# Altium project BLE-T1.PrjPcb
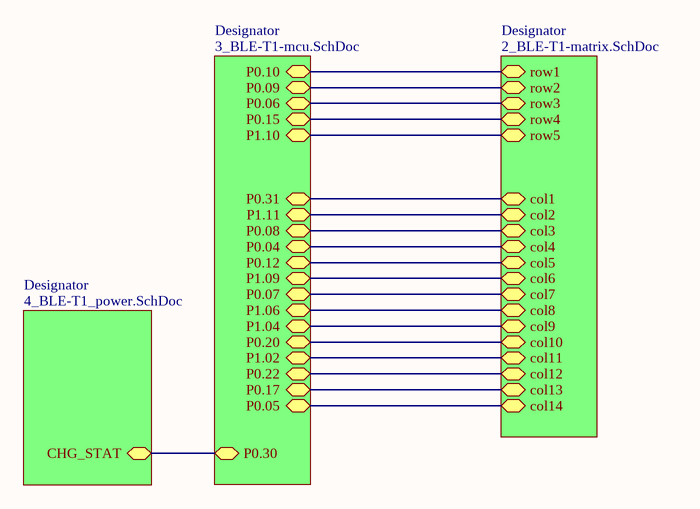
[diagram p0: 1_BLE-T1_top.SchDoc]
4 sheets, 185 parts. Net scope: hierarchical (ports join the sheet entries above them; power ports are global).
Board file: BLE-T1.PcbDoc
Sheets:
  1_BLE-T1_top.SchDoc
    Designator = 3_BLE-T1-mcu.SchDoc
    Designator = 2_BLE-T1-matrix.SchDoc
    Designator = 4_BLE-T1_power.SchDoc

## Sheet 1_BLE-T1_top.SchDoc: waffling60 - PCB
size A4; Engineer: 4pplet; Revision: RevA; ProjectName: waffling60

### Sub-sheets
Designator = 3_BLE-T1-mcu.SchDoc: P1.02, P1.04, P0.17, P0.09, P0.20, P1.06, P0.10, P0.22, P0.12, P0.15, P0.06, P1.09, P1.11, P0.08, P0.31, P0.04, P0.05, P1.10, P0.30, P0.07
Designator = 2_BLE-T1-matrix.SchDoc: col6, col8, col5, col7, col3, col2, col1, col4, col9, row3, row1, row4, row2, row5, col11, col10, col13, col14, col12
Designator = 4_BLE-T1_power.SchDoc: CHG_STAT

### Nets
col1: sheet Designator/P0.31, sheet Designator/col1
col2: sheet Designator/P1.11, sheet Designator/col2
col3: sheet Designator/P0.08, sheet Designator/col3
col4: sheet Designator/P0.04, sheet Designator/col4
col5: sheet Designator/P0.12, sheet Designator/col5
col6: sheet Designator/P1.09, sheet Designator/col6
col7: sheet Designator/P0.07, sheet Designator/col7
col8: sheet Designator/P1.06, sheet Designator/col8
col9: sheet Designator/P1.04, sheet Designator/col9
col10: sheet Designator/P0.20, sheet Designator/col10
col11: sheet Designator/P1.02, sheet Designator/col11
col12: sheet Designator/P0.22, sheet Designator/col12
row1: sheet Designator/P0.10, sheet Designator/row1
row2: sheet Designator/P0.09, sheet Designator/row2
row3: sheet Designator/P0.06, sheet Designator/row3
row4: sheet Designator/P0.15, sheet Designator/row4
row5: sheet Designator/P1.10, sheet Designator/row5
NetR401_2: sheet Designator/P0.30, sheet Designator/CHG_STAT
NetS213_2: sheet Designator/P0.17, sheet Designator/col13
NetS214_2: sheet Designator/P0.05, sheet Designator/col14

## Sheet 3_BLE-T1-mcu.SchDoc
size A4
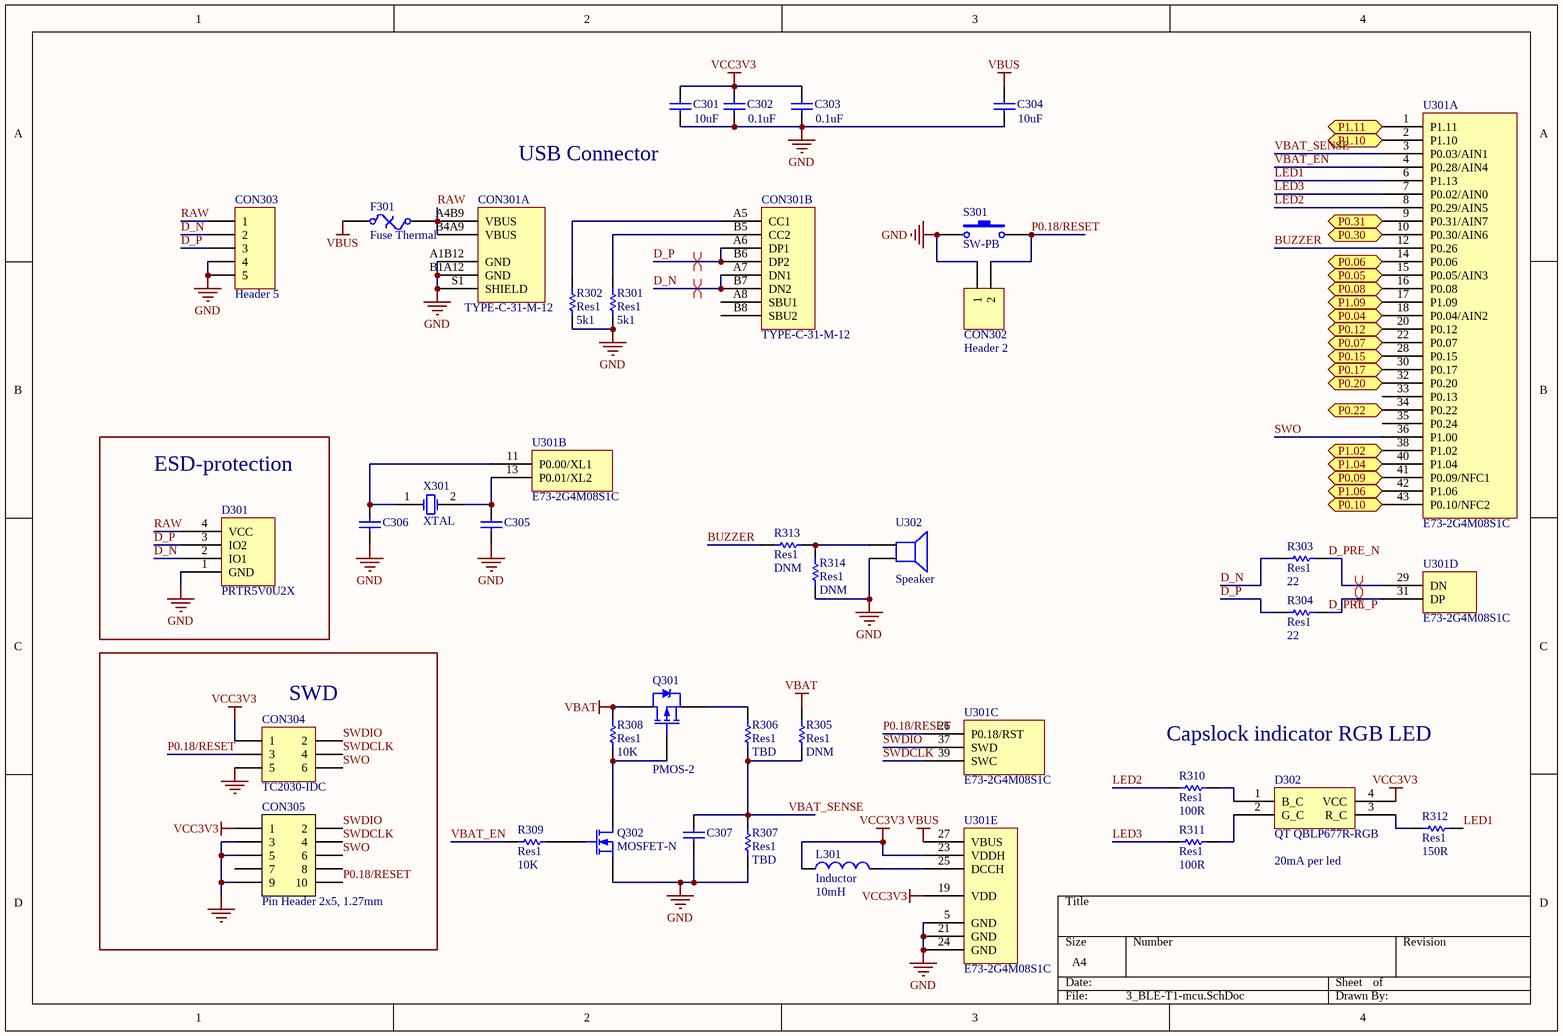
[diagram p1: 3_BLE-T1-mcu.SchDoc]

### Parts
C301  value 10uF  [C1206[3216]]
C302  value 0.1uF  [C0603[1608]]
C303  value 0.1uF  [C0603[1608]]
C304  value 10uF  [C1206[3216]]
C305  (no value)  [C0603[1608]]
C306  (no value)  [C0603[1608]]
C307  (no value)  [C0603[1608]]
CON301  TYPE-C-31-M-12  [TYPE-C-31-M-12]  (parts A,B of 2)
CON302  Header 2  [HDR1X2]  (no BOM)
CON303  Header 5  [JST SM04B-SRSS-TB]
CON304  TC2030-IDC  [TC2030-IDC-NL]  (no BOM)
CON305  Pin Header 2x5, 1.27mm  [HDR_2x5-SMD-1.27mm-K]
D301  PRTR5V0U2X  [SOT190P237X120-4N]
D302  QT QBLP677R-RGB  [QT QBLP677R-RGB]
F301  Fuse Thermal  [C1206[3216]]
L301  Inductor  value 10mH  [C0603[1608]]
Q301  PMOS-2  [SOT-23-3]
Q302  MOSFET-N  [SOT-23-3]
R301  Res1  value 5k1  [R0603[1608]]
R302  Res1  value 5k1  [R0603[1608]]
R303  Res1  value 22  [R0603[1608]]
R304  Res1  value 22  [R0603[1608]]
R305  Res1  value DNM  [R0603[1608]]
R306  Res1  value TBD  [R0603[1608]]
R307  Res1  value TBD  [R0603[1608]]
R308  Res1  value 10K  [R0603[1608]]
R309  Res1  value 10K  [R0603[1608]]
R310  Res1  value 100R  [R0603[1608]]
R311  Res1  value 100R  [R0603[1608]]
R312  Res1  value 150R  [R0603[1608]]
R313  Res1  value DNM  [R0603[1608]]
R314  Res1  value DNM  [R0603[1608]]
S301  SW-PB  [Combo switch]
U301  E73-2G4M08S1C  [E73-2G4M08S1C BLE-T1]  (parts A,B,C,D,E of 5)
U302  Speaker  [buzzer 12x12]
X301  XTAL  [Seiko Epson Q13FC1350000400]

### Blocks framed on the sheet
ESD-protection: D301
SWD: CON304 CON305

### Ports
P0.04, P0.05, P0.06, P0.07, P0.08, P0.09, P0.10, P0.12, P0.15, P0.17, P0.20, P0.22, P0.30, P0.31, P1.02, P1.04, P1.06, P1.09, P1.10, P1.11

### Nets
GND: C301.1 C302.1 C303.1 C304.1 C305.1 C306.1 C307.1 CON301.A1B12(GND) CON301.B1A12(GND) CON301.S1(SHIELD) CON302.1 CON303.4 CON303.5 CON304.5 CON305.3 CON305.5 CON305.9 D301.1(GND) Q302.2(S) R301.2 R302.2 R307.1 R314.1 S301.1 U301.5(GND) U301.21(GND) U301.24(GND) U302.2
VBAT: Q301.3(D) R305.2 R308.2
VBUS: C304.2 F301.1 U301.27(VBUS)
VCC3V3: C301.2 C302.2 C303.2 CON304.1 CON305.1 D302.4(VCC) L301.1 U301.19(VDD) U301.23(VDDH)
BUZZER: R313.1 U301.12(P0.26)
col1: U301.9(P0.31/AIN7) ; port P0.31
col2: U301.1(P1.11) ; port P1.11
col3: U301.16(P0.08) ; port P0.08
col4: U301.18(P0.04/AIN2) ; port P0.04
col5: U301.20(P0.12) ; port P0.12
col6: U301.17(P1.09) ; port P1.09
col7: U301.22(P0.07) ; port P0.07
col8: U301.42(P1.06) ; port P1.06
col9: U301.40(P1.04) ; port P1.04
col10: U301.32(P0.20) ; port P0.20
col11: U301.38(P1.02) ; port P1.02
col12: U301.34(P0.22) ; port P0.22
D_N: CON301.A7(DN1) CON301.B7(DN2) CON303.2 D301.2(IO1) R303.2
D_P: CON301.A6(DP1) CON301.B6(DP2) CON303.3 D301.3(IO2) R304.2
D_PRE_N: R303.1 U301.29(DN)
D_PRE_P: R304.1 U301.31(DP)
LED1: R312.1 U301.6(P1.13)
LED2: R310.2 U301.8(P0.29/AIN5)
LED3: R311.2 U301.7(P0.02/AIN0)
P0.18/RESET: CON302.2 CON304.3 CON305.10 S301.2 U301.26(P0.18/RST)
RAW: CON301.A4B9(VBUS) CON301.B4A9(VBUS) CON303.1 D301.4(VCC) F301.2
row1: U301.43(P0.10/NFC2) ; port P0.10
row2: U301.41(P0.09/NFC1) ; port P0.09
row3: U301.14(P0.06) ; port P0.06
row4: U301.28(P0.15) ; port P0.15
row5: U301.2(P1.10) ; port P1.10
SWDCLK: CON304.4 CON305.4 U301.39(SWC)
SWDIO: CON304.2 CON305.2 U301.37(SWD)
SWO: CON304.6 CON305.6 U301.36(P1.00)
VBAT_EN: R309.2 U301.4(P0.28/AIN4)
VBAT_SENSE: C307.2 R305.1 R306.1 R307.2 U301.3(P0.03/AIN1)
NetC305_2: C305.2 U301.13(P0.01/XL2) X301.2(OSC2)
NetC306_2: C306.2 U301.11(P0.00/XL1) X301.1(OSC1)
NetCON301_A5: CON301.A5(CC1) R302.1
NetCON301_B5: CON301.B5(CC2) R301.1
NetD302_1: D302.1(B_C) R310.1
NetD302_2: D302.2(G_C) R311.1
NetD302_3: D302.3(R_C) R312.2
NetL301_2: L301.2 U301.25(DCCH)
NetQ301_1: Q301.1(G) Q302.3(D) R308.1
NetQ301_2: Q301.2(S) R306.2
NetQ302_1: Q302.1(G) R309.1
NetR313_2: R313.2 R314.2 U302.1
NetR401_2: U301.10(P0.30/AIN6) ; port P0.30
NetS213_2: U301.30(P0.17) ; port P0.17
NetS214_2: U301.15(P0.05/AIN3) ; port P0.05

Not connected (* = marked no-connect by the designer): CON301 A8(SBU1) B8(SBU2); CON305 7 8; U301 33(P0.13) 35(P0.24)

### Layout directives
differential pair: D_N, D_P, D_PRE_N, D_PRE_P

### Notes on the sheet
- (near C301) USB Connector
- Capslock indicator RGB LED
- (near D302) 20mA per led

### Library data of the parts
C301 C304 = Cap: Capacitor; MRF.Part: C3216X7R1C106KT000N; MFG: KEMET; MFGPN: C1206C106M3PACTU; LCSC MFG: TDK; Version: 1206 imperial; LCSCPN: C342827
C302 C303 = Cap: Capacitor; MRF.Part: CC0603KRX7R9BB104; MFG: KEMET; MFGPN: C0603C104M5RACTU; LCSC MFG: YAGEO; Version: 0603 imperial; LCSCPN: C14663
C305-C307 = Cap: Capacitor; Version: 0603 imperial
CON301 = TYPE-C-31-M-12: MFG: Korean Hroparts Elec; MFGPN: TYPE-C-31-M-12; LCSC Part #: C165948; LCSC MFG: Korean Hroparts Elec; MRF.Part: TYPE-C-31-M-12
CON302 = Header 2: Header, 2-Pin; LatestRevisionDate: 17-Jul-2002; LatestRevisionNote: Re-released for DXP Platform.; Publisher: Altium Limited
CON303 = Header 5: JST for USB daughter board; MFGPN: SM04B-SRSS-TB(LF)(SN); MFG: JST Sales America Inc.; LCSC MFG: JST Sales America; LCSC Part #: C160404; MRF.Part: SM04B-SRSS-TB(LF)(SN)
CON304 = Header 3X2: Header, 3-Pin, Dual row
CON305 = Pin Header 2x5 SMD, 1.27mm, KS: Pin Header 2x5, 1.27mm (50mil), SMD, Keying Shroud; MFG: Samtec Inc.; MFGPN: FTSH-105-01-F-DV-K-TR; Value: Pin Header 2x5, 1.27mm
D301 = PRTR5V0U2X: MRF.Part: UET14A05L03; MFG: Nexperia USA Inc.; MFGPN: PRTR5V0U2X,215; LCSC MFG: Brightking Elec (TAIWAN); LCSC Part #: C78442
D302 = QT QBLP677R-RGB: RGB LED; MFG: QT Brightek (QTB); MFGPN: QBLP677R-RGB; Version: Common Anode RGB LED
F301 = Fuse Thermal: Thermal Fuse; MRF.Part: ASMD1206-050; MFG: Bel Fuse Inc.; MFGPN: 0ZCJ0050FF2G; LCSC MFG: Shenzhen JDT Fuse; LCSC Part #: C135338
L301 = Inductor: Code_IEC: 1005; Published: 8-Jun-2000; LatestRevisionDate: 29-May-2009; LatestRevisionNote: IPC-7351 Footprint Added.; PackageReference: 0402-A; Publisher: Altium Limited; PackageDescription: Chip Inductor; Code_JEITA: 0402
Q301 = PMOS-2: P-Channel Power MOSFET; Note: Pin 4 not drawn and electrically connected to Pin 2.; MFGPN: BSS84-7-F; Published: 8-Jun-2000; LatestRevisionDate: 17-Jul-2002; LatestRevisionNote: Re-released for DXP Platform.; DatasheetVersion: PD-9.390D; PackageVersion: Feb-1997; PackageReference: TO-220AB; Publisher: Altium Limited; PackageDescription: TO, Thru-Hole, Vertical, Heatsink Mounted; 3 In-Line Leads; Pitch 2.54 mm; ComponentLink1Description: Manufacturer Link; ComponentLink1URL: http://www.irf.com/; LCSCPN: C427395
Q302 = MOSFET-N: N-Channel MOSFET; MFGPN: 2N7002-7-F; LSCSPN: C501655; Published: 8-Jun-2000; LatestRevisionDate: 17-Jul-2002; LatestRevisionNote: Re-released for DXP Platform.; PackageVersion: 1995/1996; PackageReference: E3; Publisher: Altium Limited; PackageDescription: TO, Flat Index; 3 In-Line, Axial Leads; Body Dia. 4.6mm; Lead Dia. 0.5 mm (max)
R301 R302 = Res1: Resistor; MRF.Part: 0603WAF5101T5E; MFG: Panasonic Electronic Components; MFGPN: ERJ-3EKF5101V; LCSC MFG: Uniroyal Elec; Version: 0603 imperial; LCSC Part #: C23186
R303 R304 R313 R314 = Res1: Resistor; MRF.Part: 0603WAF220JT5E; MFG: Panasonic Electronic Components; MFGPN: ERJ-3EKF5101V; LCSC MFG: Uniroyal Elec; Version: 0603 imperial; LCSC Part #: C23345
R305-R309 R312 = Res1: Resistor; MFG: TE Connectivity Passive Product; MFGPN: CRGCQ0603F150R; Version: 0603 imperial
R310 R311 = Res1: Resistor; MFG: TE Connectivity Passive Product; MFGPN: CRG0603J100R; Version: 0603 imperial
S301 = SW-PB: Switch; MRF.Part: TS-1187A-C-D-B; MFGPN: PTS645SM43SMTR92 LFS; MFG: C&K; LCSC MFG: XKB Enterprise; LCSCPN: C318888
U302 = Speaker: Loudspeaker; Published: 24-Mar-1999; LatestRevisionDate: 17-Jul-2002; LatestRevisionNote: Re-released for DXP Platform.; PackageReference: PIN2; Publisher: Altium Limited
X301 = XTAL: Crystal Oscillator; MRF.Part: Q13FC1350000400; LCSC MFG: Seiko Epson; LCSC Part #: C32346

## Sheet 2_BLE-T1-matrix.SchDoc
size A3
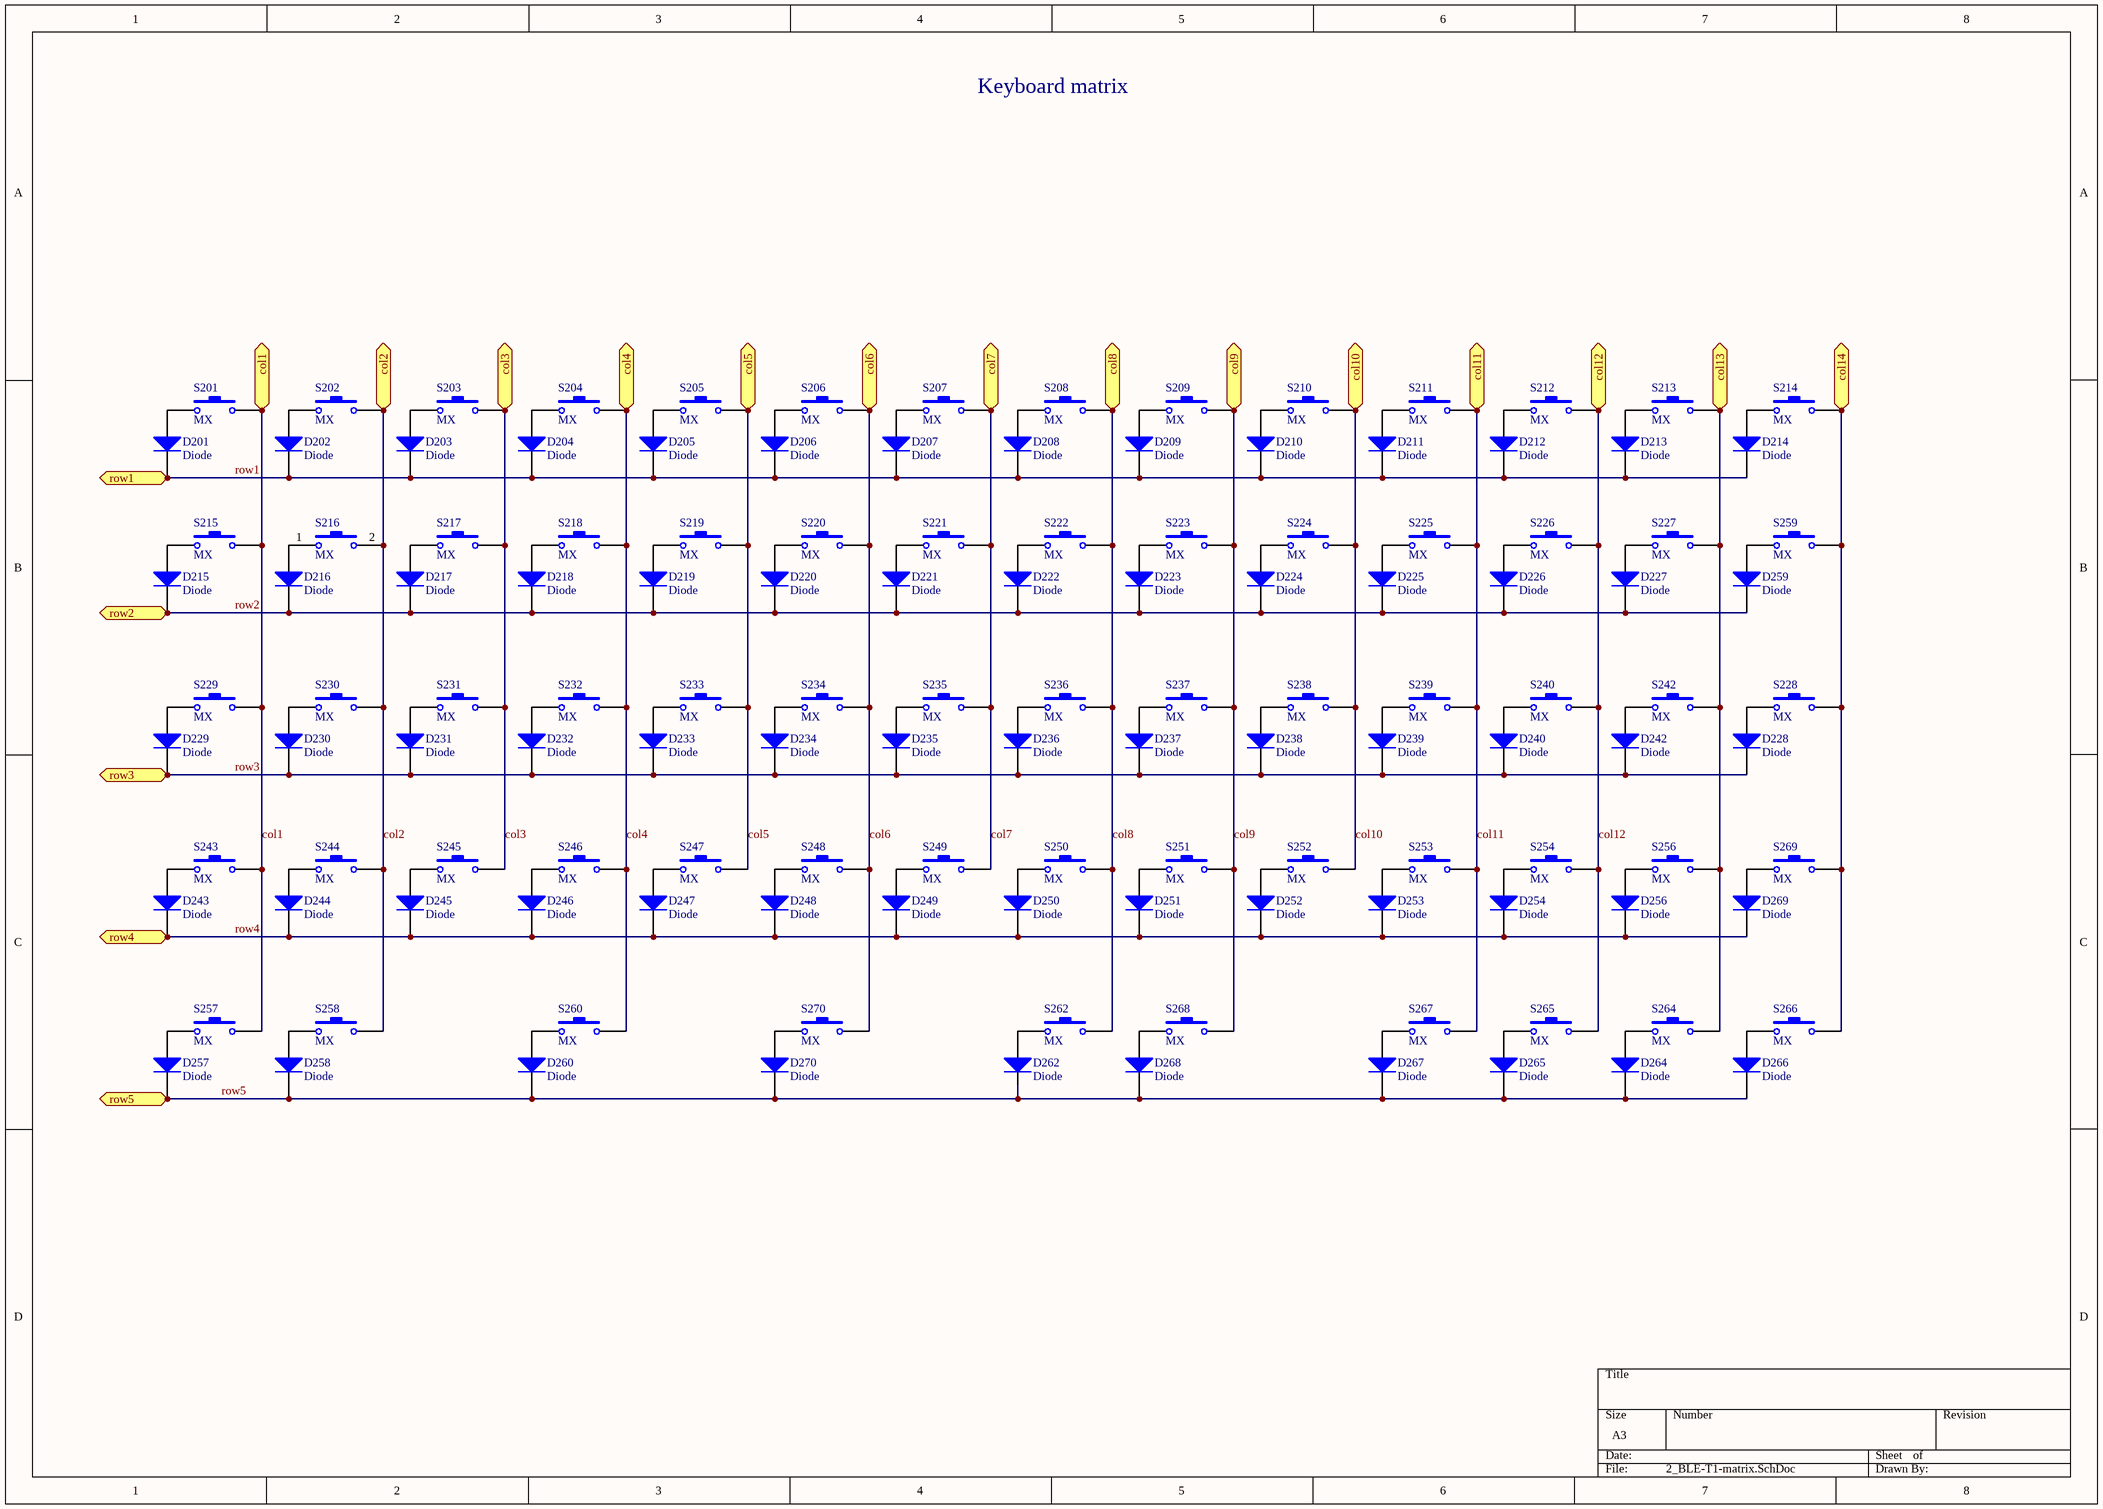
[diagram p2: 2_BLE-T1-matrix.SchDoc]

### Parts
D201  Diode  [D0603[1608]]
D202  Diode  [D0603[1608]]
D203  Diode  [D0603[1608]]
D204  Diode  [D0603[1608]]
D205  Diode  [D0603[1608]]
D206  Diode  [D0603[1608]]
D207  Diode  [D0603[1608]]
D208  Diode  [D0603[1608]]
D209  Diode  [D0603[1608]]
D210  Diode  [D0603[1608]]
D211  Diode  [D0603[1608]]
D212  Diode  [D0603[1608]]
D213  Diode  [D0603[1608]]
D214  Diode  [D0603[1608]]
D215  Diode  [D0603[1608]]
D216  Diode  [D0603[1608]]
D217  Diode  [D0603[1608]]
D218  Diode  [D0603[1608]]
D219  Diode  [D0603[1608]]
D220  Diode  [D0603[1608]]
D221  Diode  [D0603[1608]]
D222  Diode  [D0603[1608]]
D223  Diode  [D0603[1608]]
D224  Diode  [D0603[1608]]
D225  Diode  [D0603[1608]]
D226  Diode  [D0603[1608]]
D227  Diode  [D0603[1608]]
D228  Diode  [D0603[1608]]
D229  Diode  [D0603[1608]]
D230  Diode  [D0603[1608]]
D231  Diode  [D0603[1608]]
D232  Diode  [D0603[1608]]
D233  Diode  [D0603[1608]]
D234  Diode  [D0603[1608]]
D235  Diode  [D0603[1608]]
D236  Diode  [D0603[1608]]
D237  Diode  [D0603[1608]]
D238  Diode  [D0603[1608]]
D239  Diode  [D0603[1608]]
D240  Diode  [D0603[1608]]
D242  Diode  [D0603[1608]]
D243  Diode  [D0603[1608]]
D244  Diode  [D0603[1608]]
D245  Diode  [D0603[1608]]
D246  Diode  [D0603[1608]]
D247  Diode  [D0603[1608]]
D248  Diode  [D0603[1608]]
D249  Diode  [D0603[1608]]
D250  Diode  [D0603[1608]]
D251  Diode  [D0603[1608]]
D252  Diode  [D0603[1608]]
D253  Diode  [D0603[1608]]
D254  Diode  [D0603[1608]]
D256  Diode  [D0603[1608]]
D257  Diode  [D0603[1608]]
D258  Diode  [D0603[1608]]
D259  Diode  [D0603[1608]]
D260  Diode  [D0603[1608]]
D262  Diode  [D0603[1608]]
D264  Diode  [D0603[1608]]
D265  Diode  [D0603[1608]]
D266  Diode  [D0603[1608]]
D267  Diode  [D0603[1608]]
D268  Diode  [D0603[1608]]
D269  Diode  [D0603[1608]]
D270  Diode  [D0603[1608]]
S201  MX  [MX-switch - switched pol]  (no BOM)
S202  MX  [MX-switch - switched pol - connector]  (no BOM)
S203  MX  [MX-switch - switched pol]  (no BOM)
S204  MX  [MX-switch - switched pol]  (no BOM)
S205  MX  [MX-switch - switched pol]  (no BOM)
S206  MX  [MX-switch - switched pol]  (no BOM)
S207  MX  [MX-switch - switched pol]  (no BOM)
S208  MX  [MX-switch - switched pol]  (no BOM)
S209  MX  [MX-switch - switched pol]  (no BOM)
S210  MX  [MX-switch - switched pol]  (no BOM)
S211  MX  [MX-switch - switched pol]  (no BOM)
S212  MX  [MX-switch - switched pol]  (no BOM)
S213  MX  [MX-switch - switched pol]  (no BOM)
S214  MX  [MX-switch - switched pol]  (no BOM)
S215  MX  [MX-switch - 1.5U]  (no BOM)
S216  MX  [MX-switch - switched pol]  (no BOM)
S217  MX  [MX-switch - switched pol]  (no BOM)
S218  MX  [MX-switch - switched pol]  (no BOM)
S219  MX  [MX-switch - switched pol]  (no BOM)
S220  MX  [MX-switch - switched pol]  (no BOM)
S221  MX  [MX-switch - switched pol]  (no BOM)
S222  MX  [MX-switch - switched pol]  (no BOM)
S223  MX  [MX-switch - switched pol]  (no BOM)
S224  MX  [MX-switch - switched pol]  (no BOM)
S225  MX  [MX-switch - switched pol]  (no BOM)
S226  MX  [MX-switch - switched pol]  (no BOM)
S227  MX  [MX-switch - switched pol]  (no BOM)
S228  MX  [MX-switch - PIPE_ISO_ENTER]  (no BOM)
S229  MX  [MX-switch - CAPS]  (no BOM)
S230  MX  [MX-switch - switched pol]  (no BOM)
S231  MX  [MX-switch - switched pol]  (no BOM)
S232  MX  [MX-switch - switched pol]  (no BOM)
S233  MX  [MX-switch - switched pol]  (no BOM)
S234  MX  [MX-switch - switched pol]  (no BOM)
S235  MX  [MX-switch - switched pol]  (no BOM)
S236  MX  [MX-switch - switched pol]  (no BOM)
S237  MX  [MX-switch - switched pol]  (no BOM)
S238  MX  [MX-switch - switched pol]  (no BOM)
S239  MX  [MX-switch - switched pol]  (no BOM)
S240  MX  [MX-switch - switched pol]  (no BOM)
S242  MX  [MX-switch - Enter_ANSI_ISO_KEY]  (no BOM)
S243  MX  [MX-switch - Left shift]  (no BOM)
S244  MX  [MX-switch]  (no BOM)
S245  MX  [MX-switch - switched pol]  (no BOM)
S246  MX  [MX-switch - switched pol]  (no BOM)
S247  MX  [MX-switch - switched pol]  (no BOM)
S248  MX  [MX-switch - switched pol]  (no BOM)
S249  MX  [MX-switch - switched pol]  (no BOM)
S250  MX  [MX-switch - switched pol]  (no BOM)
S251  MX  [MX-switch - switched pol]  (no BOM)
S252  MX  [MX-switch - switched pol]  (no BOM)
S253  MX  [MX-switch - switched pol]  (no BOM)
S254  MX  [MX-switch - switched pol]  (no BOM)
S256  MX  [MX-switch - right shift]  (no BOM)
S257  MX  [MX-switch - 1.5u MOD-L]  (no BOM)
S258  MX  [MX-switch - 1u MOD-L]  (no BOM)
S259  MX  [MX-switch - backspace]  (no BOM)
S260  MX  [MX-switch - 1.5u MOD-L]  (no BOM)
S262  MX  [MX-switch - Space_V3]  (no BOM)
S264  MX  [MX-switch - 1u MOD-R]  (no BOM)
S265  MX  [MX-switch - 1.5u MOD-R]  (no BOM)
S266  MX  [MX-switch - 1.5u MOD-R]  (no BOM)
S267  MX  [MX-switch]  (no BOM)
S268  MX  [MX-switch - R split space_V2]  (no BOM)
S269  MX  [MX-switch]  (no BOM)
S270  MX  [MX-switch - L split space_V2]  (no BOM)

### Ports
col1, col2, col3, col4, col5, col6, col7, col8, col9, col10, col11, col12, col13, col14, row1, row2, row3, row4, row5

### Nets
col1: S201.2 S215.2 S229.2 S243.2 S257.2 ; port col1
col2: S202.2 S216.2 S230.2 S244.2 S258.2 ; port col2
col3: S203.2 S217.2 S231.2 S245.2 ; port col3
col4: S204.2 S218.2 S232.2 S246.2 S260.2 ; port col4
col5: S205.2 S219.2 S233.2 S247.2 ; port col5
col6: S206.2 S220.2 S234.2 S248.2 S270.2 ; port col6
col7: S207.2 S221.2 S235.2 S249.2 ; port col7
col8: S208.2 S222.2 S236.2 S250.2 S262.2 ; port col8
col9: S209.2 S223.2 S237.2 S251.2 S268.2 ; port col9
col10: S210.2 S224.2 S238.2 S252.2 ; port col10
col11: S211.2 S225.2 S239.2 S253.2 S267.2 ; port col11
col12: S212.2 S226.2 S240.2 S254.2 S265.2 ; port col12
row1: D201.2(K) D202.2(K) D203.2(K) D204.2(K) D205.2(K) D206.2(K) D207.2(K) D208.2(K) D209.2(K) D210.2(K) D211.2(K) D212.2(K) D213.2(K) D214.2(K) ; port row1
row2: D215.2(K) D216.2(K) D217.2(K) D218.2(K) D219.2(K) D220.2(K) D221.2(K) D222.2(K) D223.2(K) D224.2(K) D225.2(K) D226.2(K) D227.2(K) D259.2(K) ; port row2
row3: D228.2(K) D229.2(K) D230.2(K) D231.2(K) D232.2(K) D233.2(K) D234.2(K) D235.2(K) D236.2(K) D237.2(K) D238.2(K) D239.2(K) D240.2(K) D242.2(K) ; port row3
row4: D243.2(K) D244.2(K) D245.2(K) D246.2(K) D247.2(K) D248.2(K) D249.2(K) D250.2(K) D251.2(K) D252.2(K) D253.2(K) D254.2(K) D256.2(K) D269.2(K) ; port row4
row5: D257.2(K) D258.2(K) D260.2(K) D262.2(K) D264.2(K) D265.2(K) D266.2(K) D267.2(K) D268.2(K) D270.2(K) ; port row5
NetD201_1: D201.1(A) S201.1
NetD202_1: D202.1(A) S202.1
NetD203_1: D203.1(A) S203.1
NetD204_1: D204.1(A) S204.1
NetD205_1: D205.1(A) S205.1
NetD206_1: D206.1(A) S206.1
NetD207_1: D207.1(A) S207.1
NetD208_1: D208.1(A) S208.1
NetD209_1: D209.1(A) S209.1
NetD210_1: D210.1(A) S210.1
NetD211_1: D211.1(A) S211.1
NetD212_1: D212.1(A) S212.1
NetD213_1: D213.1(A) S213.1
NetD214_1: D214.1(A) S214.1
NetD215_1: D215.1(A) S215.1
NetD216_1: D216.1(A) S216.1
NetD217_1: D217.1(A) S217.1
NetD218_1: D218.1(A) S218.1
NetD219_1: D219.1(A) S219.1
NetD220_1: D220.1(A) S220.1
NetD221_1: D221.1(A) S221.1
NetD222_1: D222.1(A) S222.1
NetD223_1: D223.1(A) S223.1
NetD224_1: D224.1(A) S224.1
NetD225_1: D225.1(A) S225.1
NetD226_1: D226.1(A) S226.1
NetD227_1: D227.1(A) S227.1
NetD228_1: D228.1(A) S228.1
NetD229_1: D229.1(A) S229.1
NetD230_1: D230.1(A) S230.1
NetD231_1: D231.1(A) S231.1
NetD232_1: D232.1(A) S232.1
NetD233_1: D233.1(A) S233.1
NetD234_1: D234.1(A) S234.1
NetD235_1: D235.1(A) S235.1
NetD236_1: D236.1(A) S236.1
NetD237_1: D237.1(A) S237.1
NetD238_1: D238.1(A) S238.1
NetD239_1: D239.1(A) S239.1
NetD240_1: D240.1(A) S240.1
NetD242_1: D242.1(A) S242.1
NetD243_1: D243.1(A) S243.1
NetD244_1: D244.1(A) S244.1
NetD245_1: D245.1(A) S245.1
NetD246_1: D246.1(A) S246.1
NetD247_1: D247.1(A) S247.1
NetD248_1: D248.1(A) S248.1
NetD249_1: D249.1(A) S249.1
NetD250_1: D250.1(A) S250.1
NetD251_1: D251.1(A) S251.1
NetD252_1: D252.1(A) S252.1
NetD253_1: D253.1(A) S253.1
NetD254_1: D254.1(A) S254.1
NetD256_1: D256.1(A) S256.1
NetD257_1: D257.1(A) S257.1
NetD258_1: D258.1(A) S258.1
NetD259_1: D259.1(A) S259.1
NetD260_1: D260.1(A) S260.1
NetD262_1: D262.1(A) S262.1
NetD264_1: D264.1(A) S264.1
NetD265_1: D265.1(A) S265.1
NetD266_1: D266.1(A) S266.1
NetD267_1: D267.1(A) S267.1
NetD268_1: D268.1(A) S268.1
NetD269_1: D269.1(A) S269.1
NetD270_1: D270.1(A) S270.1
NetS213_2: S213.2 S227.2 S242.2 S256.2 S264.2 ; port col13
NetS214_2: S214.2 S228.2 S259.2 S266.2 S269.2 ; port col14

### Notes on the sheet
- Keyboard matrix

### Library data of the parts
D201-D240 D242-D254 D256-D260 D262 D264-D270 = Diode: Default Diode; MRF.Part: CD4148WTP; MFG: Bourns Inc.; MFGPN: CD0603-B0340R; LCSC MFG: Brightking Elec (TAIWAN); Version: 0603 imperial; LCSC Part #: C109002
S201-S214 S216-S240 S242-S254 S256-S260 S262 S264-S270 = SW-PB: Switch
S215 = SW-PB: TAB

## Sheet 4_BLE-T1_power.SchDoc: PCA10056 - nRF52840 MCU
size A3; Organization: Nordic Semiconductor; DocumentNumber: 2; SheetNumber: 2; SheetTotal: 7; CompanyName: Nordic Semiconductor; ProjectName: BLE-T1.PrjPcb
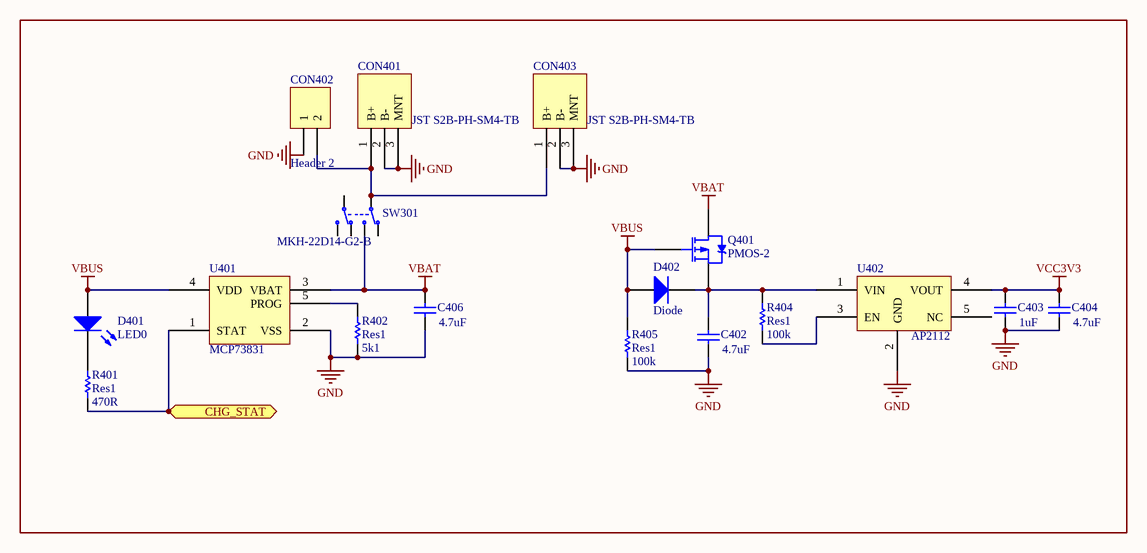
[diagram p3: 4_BLE-T1_power.SchDoc]

### Parts
C402  value 4.7uF  [C1206[3216]]
C403  value 1uF  [C0603[1608]]
C404  value 4.7uF  [C1206[3216]]
C406  value 4.7uF  [C1206[3216]]
CON401  JST S2B-PH-SM4-TB  [JST S2B-PH-SM4-TB]
CON402  Header 2  [HDR1X2]  (no BOM)
CON403  JST S2B-PH-SM4-TB  [JST SM02B-SRSS-TB]
D401  LED0  [LED0603[1608]]
D402  Diode  [D0603[1608]]
Q401  PMOS-2  [SOT-23-3]
R401  Res1  value 470R  [R0603[1608]]
R402  Res1  value 5k1  [R0603[1608]]
R404  Res1  value 100k  [R0603[1608]]
R405  Res1  value 100k  [R0603[1608]]
SW301  MKH-22D14-G2-B  [MKH-22D14-G2-B]
U401  MCP73831  [SOT-23-5]
U402  AP2112  [SOT-23-5]

### Ports
CHG_STAT

### Nets
GND: C402.1 C403.1 C404.1 C406.1 CON401.2(B-) CON401.3(MNT) CON402.1 CON403.2(B-) CON403.3(MNT) R402.2 R405.2 U401.2(VSS) U402.2(GND)
VBAT: C406.2 Q401.3(D) SW301.1(N.O-1) U401.3(VBAT)
VBUS: D401.1(A) D402.1(A) Q401.1(G) R405.1 U401.4(VDD)
VCC3V3: C403.2 C404.2 U402.4(VOUT)
NetC402_2: C402.2 D402.2(K) Q401.2(S) R404.1 U402.1(VIN)
NetCON401_1: CON401.1(B+) CON402.2 CON403.1(B+) SW301.2(COM-1)
NetD401_2: D401.2(K) R401.1
NetR401_2: R401.2 U401.1(STAT) ; port CHG_STAT
NetR402_1: R402.1 U401.5(PROG)
NetR404_2: R404.2 U402.3(EN)

Not connected (* = marked no-connect by the designer): SW301 3(N.C-1) 4(N.O-2) 5(COM-2) 6(N.C-2); U402 5(NC)

### Notes on the sheet
- Title
- Size:
- Date:
- A3
- Number:
- Time:
- Revision:
- Sheet
- of
- File:

### Library data of the parts
C402 C404 C406 = Cap: Capacitor; Version: 1206 imperial
C403 = Cap: Capacitor; MRF.Part: 1206B475K500NT; MFG: KEMET; MFGPN: C0603C104M5RACTU; LCSC MFG: Guangdong Fenghua Advanced Tech; Version: 0603 imperial; LCSCPN: C29823
CON401 CON403 = JST S2B-PH-SM4-TB: MFGPN: S2B-PH-SM4-TB(LF)(SN); MFG: JST Sales America Inc.
CON402 = Header 2: Header, 2-Pin
D401 = LED0: Typical INFRARED GaAs LED; MFGPN: AM2520SECK09; MFG: Kingbright
D402 = Diode: Default Diode; Published: 8-Jun-2000; LatestRevisionDate: 17-Jul-2002; LatestRevisionNote: Re-released for DXP Platform.; PackageVersion: Sep-1996; PackageReference: SMC; Publisher: Altium Limited; PackageDescription: DO-214-AB/SMC; 2 C-Bend Leads; Body 7.9 x 5.9 mm, inc. leads (LxW); Code_JEDEC: DO-214-AB
Q401 = PMOS-2: as Q301 on sheet 3_BLE-T1-mcu; Published: 8-Jun-2000; LatestRevisionDate: 17-Jul-2002; LatestRevisionNote: Re-released for DXP Platform.; DatasheetVersion: PD-9.390D; PackageVersion: Feb-1997; PackageReference: TO-220AB; Publisher: Altium Limited; PackageDescription: TO, Thru-Hole, Vertical, Heatsink Mounted; 3 In-Line Leads; Pitch 2.54 mm; ComponentLink1Description: Manufacturer Link; ComponentLink1URL: http://www.irf.com/; LCSCPN: C427395
R401 R402 R404 R405 = Res1: as R305 on sheet 3_BLE-T1-mcu; Version: 0603 imperial
SW301 = MKH-22D14-G2-B: Slide Switch DPDT; MFG: Nidec Copal Electronics; MFGPN: CL-SB-22B-11T; Value: MKH-22D14-G2-B

## Nets that join several sheets
GND: 3_BLE-T1-mcu (28 pins), 4_BLE-T1_power (13 pins)
VBAT: 3_BLE-T1-mcu (Q301.3 R305.2 R308.2), 4_BLE-T1_power (C406.2 Q401.3 SW301.1 U401.3)
VBUS: 3_BLE-T1-mcu (C304.2 F301.1 U301.27), 4_BLE-T1_power (5 pins)
VCC3V3: 3_BLE-T1-mcu (9 pins), 4_BLE-T1_power (C403.2 C404.2 U402.4)
col1: 3_BLE-T1-mcu (U301.9), 2_BLE-T1-matrix (5 pins)
col2: 3_BLE-T1-mcu (U301.1), 2_BLE-T1-matrix (5 pins)
col3: 3_BLE-T1-mcu (U301.16), 2_BLE-T1-matrix (S203.2 S217.2 S231.2 S245.2)
col4: 3_BLE-T1-mcu (U301.18), 2_BLE-T1-matrix (5 pins)
col5: 3_BLE-T1-mcu (U301.20), 2_BLE-T1-matrix (S205.2 S219.2 S233.2 S247.2)
col6: 3_BLE-T1-mcu (U301.17), 2_BLE-T1-matrix (5 pins)
col7: 3_BLE-T1-mcu (U301.22), 2_BLE-T1-matrix (S207.2 S221.2 S235.2 S249.2)
col8: 3_BLE-T1-mcu (U301.42), 2_BLE-T1-matrix (5 pins)
col9: 3_BLE-T1-mcu (U301.40), 2_BLE-T1-matrix (5 pins)
col10: 3_BLE-T1-mcu (U301.32), 2_BLE-T1-matrix (S210.2 S224.2 S238.2 S252.2)
col11: 3_BLE-T1-mcu (U301.38), 2_BLE-T1-matrix (5 pins)
col12: 3_BLE-T1-mcu (U301.34), 2_BLE-T1-matrix (5 pins)
NetR401_2: 3_BLE-T1-mcu (U301.10), 4_BLE-T1_power (R401.2 U401.1)
NetS213_2: 3_BLE-T1-mcu (U301.30), 2_BLE-T1-matrix (5 pins)
NetS214_2: 3_BLE-T1-mcu (U301.15), 2_BLE-T1-matrix (5 pins)
row1: 3_BLE-T1-mcu (U301.43), 2_BLE-T1-matrix (14 pins)
row2: 3_BLE-T1-mcu (U301.41), 2_BLE-T1-matrix (14 pins)
row3: 3_BLE-T1-mcu (U301.14), 2_BLE-T1-matrix (14 pins)
row4: 3_BLE-T1-mcu (U301.28), 2_BLE-T1-matrix (14 pins)
row5: 3_BLE-T1-mcu (U301.2), 2_BLE-T1-matrix (10 pins)